# EAGLE design NP_5x5_2020 (EAGLE 6.5.0)
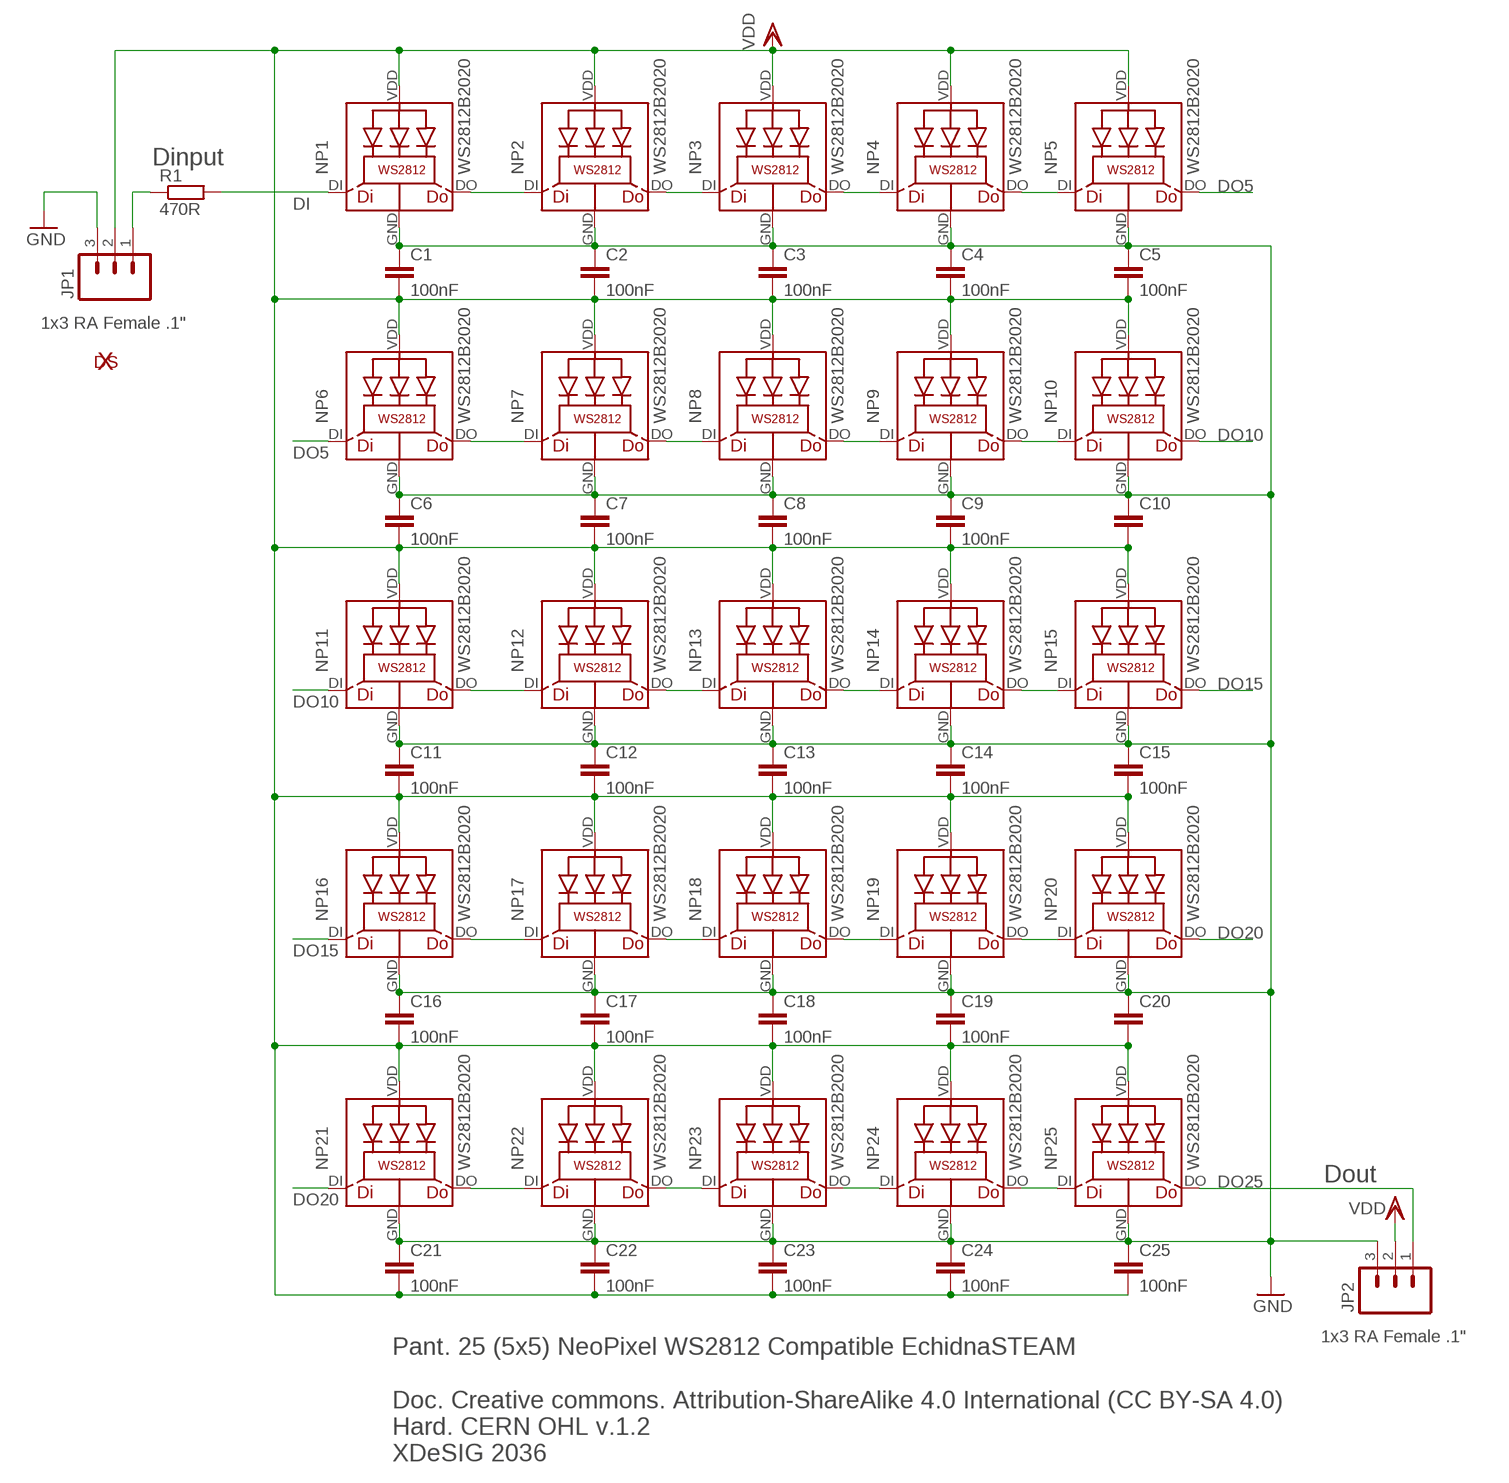
[diagram p0: schematic, sheet 1]

## Parts
C1  100nF  C-EUC0402  [C0402]
C2  100nF  C-EUC0402  [C0402]
C3  100nF  C-EUC0402  [C0402]
C4  100nF  C-EUC0402  [C0402]
C5  100nF  C-EUC0402  [C0402]
C6  100nF  C-EUC0402  [C0402]
C7  100nF  C-EUC0402  [C0402]
C8  100nF  C-EUC0402  [C0402]
C9  100nF  C-EUC0402  [C0402]
C10  C-EUC0402  [C0402]
C11  100nF  C-EUC0402  [C0402]
C12  100nF  C-EUC0402  [C0402]
C13  100nF  C-EUC0402  [C0402]
C14  100nF  C-EUC0402  [C0402]
C15  100nF  C-EUC0402  [C0402]
C16  100nF  C-EUC0402  [C0402]
C17  100nF  C-EUC0402  [C0402]
C18  100nF  C-EUC0402  [C0402]
C19  100nF  C-EUC0402  [C0402]
C20  C-EUC0402  [C0402]
C21  100nF  C-EUC0402  [C0402]
C22  100nF  C-EUC0402  [C0402]
C23  100nF  C-EUC0402  [C0402]
C24  100nF  C-EUC0402  [C0402]
C25  100nF  C-EUC0402  [C0402]
JP1  1x3 RA Female .1"  M03SMD_RA_FEMALE  [1X03_SMD_RA_FEMALE]
JP2  1x3 RA Female .1"  M03SMD_RA_FEMALE  [1X03_SMD_RA_FEMALE]
NP1  WS2812B2020  [2020]
NP2  WS2812B2020  [2020]
NP3  WS2812B2020  [2020]
NP4  WS2812B2020  [2020]
NP5  WS2812B2020  [2020]
NP6  WS2812B2020  [2020]
NP7  WS2812B2020  [2020]
NP8  WS2812B2020  [2020]
NP9  WS2812B2020  [2020]
NP10  WS2812B2020  [2020]
NP11  WS2812B2020  [2020]
NP12  WS2812B2020  [2020]
NP13  WS2812B2020  [2020]
NP14  WS2812B2020  [2020]
NP15  WS2812B2020  [2020]
NP16  WS2812B2020  [2020]
NP17  WS2812B2020  [2020]
NP18  WS2812B2020  [2020]
NP19  WS2812B2020  [2020]
NP20  WS2812B2020  [2020]
NP21  WS2812B2020  [2020]
NP22  WS2812B2020  [2020]
NP23  WS2812B2020  [2020]
NP24  WS2812B2020  [2020]
NP25  WS2812B2020  [2020]
R1  470R  R-EU_R0603  [R0603]
U$1  XDESIG_XDESIG5MM  [XDESIG_XDESIG_CU]

## Nets
DI: NP1.DI R1.2
DO5: NP5.DO NP6.DI
DO10: NP10.DO NP11.DI
DO15: NP15.DO NP16.DI
DO20: NP20.DO NP21.DI
DO25: JP2.1 NP25.DO
GND: C1.1 C2.1 C3.1 C4.1 C5.1 C6.1 C7.1 C8.1 C9.1 C10.1 C11.1 C12.1 C13.1 C14.1 C15.1 C16.1 C17.1 C18.1 C19.1 C20.1 C21.1 C22.1 C23.1 C24.1 C25.1 JP1.3 JP2.3 NP1.GND NP2.GND NP3.GND NP4.GND NP5.GND NP6.GND NP7.GND NP8.GND NP9.GND NP10.GND NP11.GND NP12.GND NP13.GND NP14.GND NP15.GND NP16.GND NP17.GND NP18.GND NP19.GND NP20.GND NP21.GND NP22.GND NP23.GND NP24.GND NP25.GND
N$1: NP1.DO NP2.DI
N$2: NP2.DO NP3.DI
N$3: NP3.DO NP4.DI
N$4: NP4.DO NP5.DI
N$5: NP22.DO NP23.DI
N$6: NP23.DO NP24.DI
N$7: NP6.DO NP7.DI
N$8: NP7.DO NP8.DI
N$9: NP8.DO NP9.DI
N$10: NP9.DO NP10.DI
N$11: NP11.DO NP12.DI
N$12: NP12.DO NP13.DI
N$13: NP13.DO NP14.DI
N$14: NP14.DO NP15.DI
N$15: NP16.DO NP17.DI
N$16: NP17.DO NP18.DI
N$17: NP18.DO NP19.DI
N$18: NP19.DO NP20.DI
N$19: NP21.DO NP22.DI
N$20: NP24.DO NP25.DI
N$21: JP1.1 R1.1
VDD: C1.2 C2.2 C3.2 C4.2 C5.2 C6.2 C7.2 C8.2 C9.2 C10.2 C11.2 C12.2 C13.2 C14.2 C15.2 C16.2 C17.2 C18.2 C19.2 C20.2 C21.2 C22.2 C23.2 C24.2 C25.2 JP1.2 JP2.2 NP1.VDD(LEDVDD) NP2.VDD(LEDVDD) NP3.VDD(LEDVDD) NP4.VDD(LEDVDD) NP5.VDD(LEDVDD) NP6.VDD(LEDVDD) NP7.VDD(LEDVDD) NP8.VDD(LEDVDD) NP9.VDD(LEDVDD) NP10.VDD(LEDVDD) NP11.VDD(LEDVDD) NP12.VDD(LEDVDD) NP13.VDD(LEDVDD) NP14.VDD(LEDVDD) NP15.VDD(LEDVDD) NP16.VDD(LEDVDD) NP17.VDD(LEDVDD) NP18.VDD(LEDVDD) NP19.VDD(LEDVDD) NP20.VDD(LEDVDD) NP21.VDD(LEDVDD) NP22.VDD(LEDVDD) NP23.VDD(LEDVDD) NP24.VDD(LEDVDD) NP25.VDD(LEDVDD)

## Notes on the sheet
- Dinput
- Dout
- Pant. 25 (5x5) NeoPixel WS2812 Compatible EchidnaSTEAM 
  
  Doc. Creative commons. Attribution-ShareAlike 4.0 International (CC BY-SA 4.0) 
  Hard. CERN OHL v.1.2
  XDeSIG 2036

## Library data of the parts
C1-C25 = rcl:C-EU: CAPACITOR, European symbol
JP1 JP2 = SparkFun-Connectors:M03: Header 3 Standard 3-pin 0.1" header. Use with straight break away headers (SKU : PRT-00116), right angle break away headers (PRT-00553), swiss pins (PRT-00743), machine pins (PRT-00117), and female headers (PRT-00115). Molex polarized connector foot print use with SKU : PRT-08232 with associated crimp pins and housings.; PROD_ID: CONN-10926
NP1-NP25 = adafruit:WS2812B
R1 = rcl:R-EU_: RESISTOR, European symbol
U$1 = cervus2.100:XDESIG_XDESIG

## Board
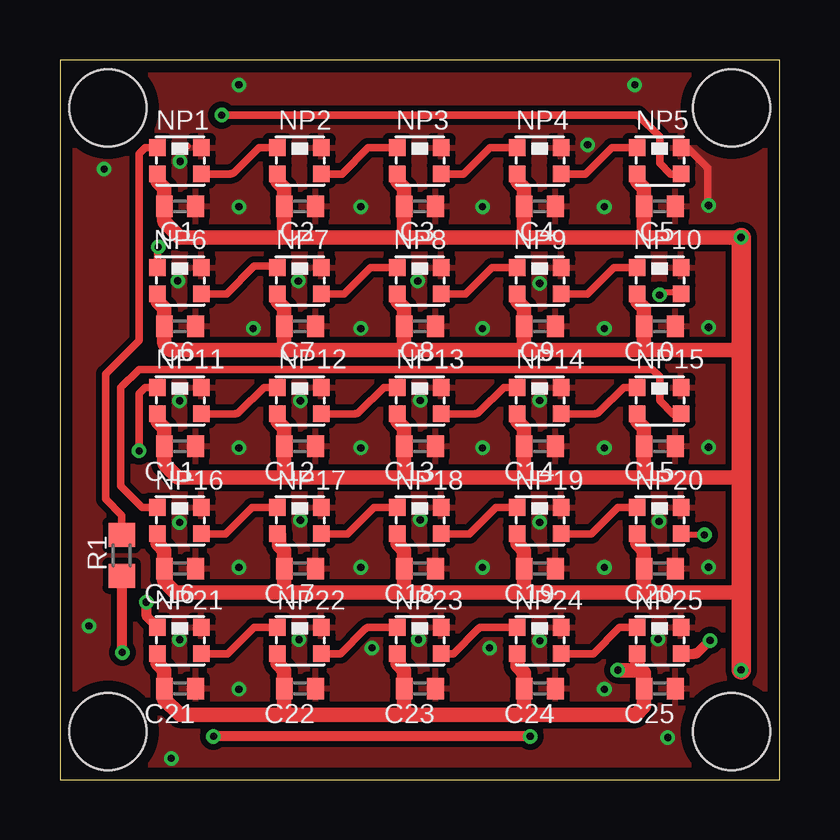
[diagram p1: board, top side]
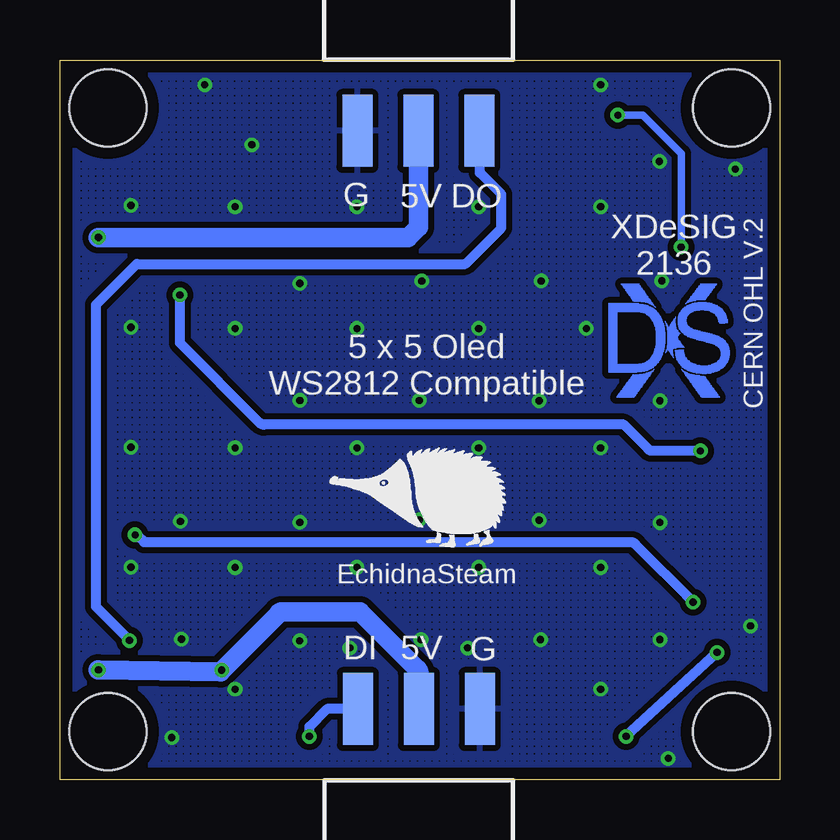
[diagram p2: board, bottom side, seen from below]

Size 30 x 30 mm. Coordinates in mm from the lower left corner, seen from the top.
Outline: 0,0 30,0 30,30 0,30 0,0
Copper layers (1*16): Top 0.035mm / dielectric 1.6mm / Bottom 0.035mm
Design rules "Elecrow_2-layer_PCB_eagle_rule": minimum track width 6mil, minimum drill 12mil, track to track 6mil, track to pad 8mil, pad to pad 12mil, via to via 12mil, smd to smd 0mil, copper to edge 20mil, drill to drill 10mil, minimum pad ring 6mil, minimum via ring 6mil, stop-mask expansion 0mil, vias tented up to drill 100mil, thermal gap 10mil
Holes 3.2 mm at 2,28 28,28 2,2 28,2

### Footprints (pad centres in the part's own frame; a part is rotated, then mirrored left to right if it is on the bottom)
C0402 = smd 0.7 x 0.9: 1 -0.65,0; 2 0.65,0
1X03_SMD_RA_FEMALE = smd 1.25 x 3: 1 -2.54,7.225; 2 0,7.225; 3 2.54,7.225
2020 = smd 0.7 x 0.7: DI -0.935,0.55; DO 0.895,-0.55; GND 0.895,0.55; VDD -0.935,-0.55
R0603 = smd 1 x 1.1: 1 -0.85,0; 2 0.85,0

### Placement (x,y rotation side)
C1  5,23.9 180 top
C2  10,23.9 180 top
C3  15,23.9 180 top
C4  20,23.9 180 top
C5  25,23.9 180 top
C6  5,18.9 180 top
C7  10,18.9 180 top
C8  15,18.9 180 top
C9  20,18.9 180 top
C10  25,18.9 180 top
C11  5,13.9 180 top
C12  10,13.9 180 top
C13  15,13.9 180 top
C14  20,13.9 180 top
C15  25,13.9 180 top
C16  5,8.8 180 top
C17  10,8.8 180 top
C18  15,8.8 180 top
C19  20,8.8 180 top
C20  25,8.8 180 top
C21  5,3.8 180 top
C22  10,3.8 180 top
C23  15,3.8 180 top
C24  20,3.8 180 top
C25  25,3.8 180 top
JP1  15.04,-4.28 0 bottom
JP2  15.06,34.27 180 bottom
NP1  5,25.8 0 top
NP2  10,25.8 0 top
NP3  15,25.8 0 top
NP4  20,25.8 0 top
NP5  25,25.8 0 top
NP6  5,20.8 0 top
NP7  10,20.8 0 top
NP8  15,20.8 0 top
NP9  20,20.8 0 top
NP10  25,20.8 0 top
NP11  5,15.8 0 top
NP12  10,15.8 0 top
NP13  15,15.8 0 top
NP14  20,15.8 0 top
NP15  25,15.8 0 top
NP16  5,10.8 0 top
NP17  10,10.8 0 top
NP18  15,10.8 0 top
NP19  20,10.8 0 top
NP20  25,10.8 0 top
NP21  5,5.8 0 top
NP22  10,5.8 0 top
NP23  15,5.8 0 top
NP24  20,5.8 0 top
NP25  25,5.8 0 top
R1  2.58,9.34 90 top
U$1  7.13,15.93 0 bottom
U$3  [ECHIDNA_P]  18.8,9.64 0 bottom

### Tracks (layer width: path | path; a pad name or v marks a point on that pad's centre or on a via)
DI
  Top 0.305: R1.2 2.58,11.02 1.9,11.7 1.9,16.9 3.3,18.3 3.3,26.1 3.55,26.35 NP1.DI
DO5  (via drill 0.3)
  Top 0.305: NP6.DI 4.07,22.07 v4.1,22.2 | 8.65,27.7 v6.74,27.7 24.1,27.7 25,26.8 25,25.7 25.45,25.25 NP5.DO
  Bottom 0.305: v4.1,22.2 4.1,26.1 5.7,27.7 v6.74,27.7
DO10  (via drill 0.3)
  Top 0.254: NP10.DO 25.65,20.32 25.15,20.32 v25,20.2
  Top 0.305: v3.3,13.7 3.3,16.1 3.55,16.35 NP11.DI
  Bottom 0.406: 25,20.02 v25,20.2 25,18.2 21.67,14.87 arc-45 21.5,14.8 6.5,14.8 5.47,13.77 arc-45 5.29,13.7 v3.3,13.7
DO15
  Top 0.305: NP16.DI 3.42,11.35 2.54,12.23 2.54,16.34 3.3,17.1 24.7,17.1 25,16.8 25,15.8 25.55,15.25 NP15.DO
DO20  (via drill 0.3)
  Top 0.254: v26.87,10.2 25.84,10.2 NP20.DO
  Top 0.406: v3.6,7.4 3.6,6.92 arc45 3.67,6.74 NP21.DI
  Bottom 0.406: 3.93,7.73 v3.6,7.4 6.03,9.83 arc-45 6.21,9.9 26.5,9.9 26.75,10.15 arc-45 v26.87,10.2
DO25  (via drill 0.3)
  Top 0.406: NP25.DO 26.45,5.25 arc45 26.62,5.32 v27.1,5.8
  Bottom 0.406: 12.2,27.02 JP2.1 12.5,27.02 12.5,25.3 11.6,24.4 11.6,23 13.1,21.5 26.8,21.5 28.5,19.8 28.5,7.2 v27.1,5.8
GND  (via drill 0.3)
  Top 0.254: C21.1 5.59,3.85 5.7,3.85 | NP1.GND 5.84,26.42 5.84,26.4 | 5.33,26.42 5.33,26.4
  Top 0.305: NP5.GND 26.15,26.35 27,25.5 27,23.97 v27.04,23.93
  other vias: 7.46,23.88 12.54,23.88 17.62,23.88 22.7,23.88 8.06,18.8 12.54,18.8 17.62,18.8 22.7,18.8 7.46,13.82 12.54,13.82 17.62,13.82 22.7,13.82 7.46,8.84 12.54,8.84 17.62,8.84 22.7,8.84 7.46,3.76 22.7,3.76 25.34,1.75 24.94,5.85 27.04,8.85 27.04,13.85 27.04,18.85 7.46,28.96 20,20.68 22,26.46 14.92,20.78 9.94,20.78 4.91,20.79 5.01,25.77 20,15.8 15.02,15.8 4.99,15.79 10.02,15.79 4.99,10.71 10.02,10.81 15.02,10.82 20,10.72 24.98,10.76 4.99,5.83 9.97,5.83 14.95,5.83 20.01,5.78 17.91,5.48 13.01,5.48 1.84,25.45 1.21,6.4 4.64,0.88 23.97,28.96
  pour Bottom (isolate 0.254, hatched): 0,0 0.1,30.28 30.33,30.28 arc-90 30.48,30.23 30.48,0
  pour Top (isolate 0.254): 0,0 0,30.68 28.96,30.68 arc-90 30.51,30.33 30.51,0.1
N$1
  Top 0.305: NP1.DO 7.09,25.25 arc45 7.27,25.32 8.3,26.35 NP2.DI
N$2
  Top 0.305: NP2.DO 11.75,25.25 12.85,26.35 NP3.DI
N$3
  Top 0.305: NP3.DO 16.83,25.25 17.93,26.35 NP4.DI
N$4
  Top 0.305: NP4.DO 21.91,25.25 23.01,26.35 NP5.DI
N$5
  Top 0.305: NP22.DO 11.7,5.25 12.73,6.28 arc-45 12.9,6.35 NP23.DI
N$6
  Top 0.305: NP23.DO 16.4,5.25 17.43,6.28 arc-45 17.61,6.35 NP24.DI
N$7
  Top 0.305: NP6.DO 6.95,20.25 8.1,21.4 9.02,21.4 NP7.DI
N$8
  Top 0.305: NP8.DI 12.95,21.35 11.85,20.25 NP7.DO
N$9
  Top 0.305: NP8.DO 16.91,20.25 18.01,21.35 NP9.DI
N$10
  Top 0.305: NP9.DO 21.99,20.25 23.09,21.35 NP10.DI
N$11
  Top 0.305: NP11.DO 7.29,15.25 arc45 7.47,15.32 8.5,16.35 NP12.DI
N$12
  Top 0.305: NP12.DO 12.29,15.25 arc45 12.47,15.32 13.5,16.35 NP13.DI
N$13
  Top 0.305: NP13.DO 17.3,15.25 arc45 17.47,15.32 18.5,16.35 NP14.DI
N$14
  Top 0.305: NP14.DO 22.3,15.25 arc45 22.47,15.32 23.5,16.35 NP15.DI
N$15
  Top 0.305: NP16.DO 6.91,10.25 8.01,11.35 NP17.DI
N$16
  Top 0.305: NP17.DO 11.99,10.25 13.09,11.35 NP18.DI
N$17
  Top 0.305: NP18.DO 17.07,10.25 18.17,11.35 NP19.DI
N$18
  Top 0.305: NP19.DO 22.15,10.25 23.25,11.35 NP20.DI
N$19
  Top 0.305: NP21.DO 6.99,5.25 8.09,6.35 NP22.DI
N$20
  Top 0.305: NP24.DO 22.23,5.25 23.33,6.35 NP25.DI
N$21  (via drill 0.3)
  Top 0.406: v19.6,1.8 v6.4,1.8 | R1.1 2.58,5.32 v2.6,5.3
  Bottom 0.406: v19.6,1.8 19.6,2.2 18.86,2.94 JP1.1 | v6.4,1.8 v2.6,5.3
VDD  (via drill 0.3)
  Top 0.254: 9.14,10.2 NP17.VDD | 13.97,25.15 NP3.VDD
  Top 0.61: NP25.VDD 24.07,4.74 24.15,4.65 | 24.15,4.65 24.35,4.45 C25.2 24.35,3.05 24,2.7 19.3,2.7 | NP24.VDD 19.07,4.74 19.35,4.45 C24.2 19.35,2.75 19.3,2.7 | NP23.VDD 14.06,4.83 14.35,4.55 C23.2 14.35,2.75 14.4,2.7 | NP22.VDD 9.06,4.83 9.35,4.55 C22.2 9.35,2.75 9.3,2.7 | NP21.VDD 4.07,4.83 4.35,4.55 C21.2 4.35,3.35 5,2.7 9.3,2.7 | NP20.VDD 24.07,9.84 24.35,9.55 C20.2 24.35,7.92 arc45 24.38,7.84 arc45 24.4,7.8 | NP1.VDD 4.07,24.93 4.35,24.65 C1.2 4.35,23.36 arc45 4.42,23.18 5,22.6 9.5,22.6 | NP2.VDD 9.06,24.93 9.35,24.65 C2.2 9.35,22.86 arc45 9.42,22.68 9.5,22.6 | NP3.VDD 14.06,24.93 14.35,24.65 C3.2 14.35,22.72 arc-45 14.3,22.6 | NP4.VDD 19.07,24.93 19.35,24.65 C4.2 19.35,22.72 arc-45 19.3,22.6 | NP5.VDD 24.07,24.93 24.35,24.65 C5.2 24.35,22.72 arc45 24.4,22.6 | NP6.VDD 4.07,19.93 4.35,19.65 C6.2 4.35,18.25 arc45 4.42,18.08 4.6,17.9 9.3,17.9 | NP7.VDD 9.06,19.93 9.35,19.65 C7.2 9.35,18.02 arc-45 9.3,17.9 | NP8.VDD 14.06,19.93 14.35,19.65 C8.2 14.35,18.02 arc45 14.4,17.9 | NP9.VDD 19.07,19.93 19.35,19.65 C9.2 19.35,18.02 arc-45 19.3,17.9 | NP10.VDD 24.07,19.93 24.35,19.65 C10.2 24.35,18.02 arc45 24.4,17.9 | NP19.VDD 19.07,9.84 19.35,9.55 C19.2 19.35,7.92 arc45 19.4,7.8 | NP18.VDD 14.06,9.84 14.35,9.55 C18.2 14.35,7.92 arc45 14.4,7.8 | 9.14,10.2 9.14,9.76 9.35,9.55 C17.2 9.35,7.92 arc-45 9.3,7.8 | NP16.VDD 4.07,9.84 4.35,9.55 C16.2 4.35,8.36 arc45 4.42,8.18 4.8,7.8 9.3,7.8 | NP11.VDD 4.07,14.94 4.35,14.65 C11.2 4.35,13.26 arc45 4.42,13.08 4.9,12.6 9.4,12.6 | NP12.VDD 9.06,14.94 9.35,14.65 C12.2 9.35,12.72 arc45 9.4,12.6 | NP13.VDD 14.06,14.94 14.35,14.65 C13.2 14.35,12.72 arc45 14.4,12.6
  Top 0.61: NP14.VDD 19.07,14.94 19.35,14.65 C14.2 19.35,12.72 arc-45 19.3,12.6 | NP15.VDD 24.07,14.94 24.35,14.65 C15.2 24.35,12.86 arc45 24.42,12.68 24.5,12.6 | 9.5,22.6 14.3,22.6 | 14.3,22.6 19.3,22.6 | 19.3,22.6 24.4,22.6 | 24.4,22.6 v28.4,22.6 | 9.3,17.9 14.4,17.9 | 14.4,17.9 19.3,17.9 | 19.3,17.9 24.4,17.9 | 24.4,17.9 28.4,17.9 | 9.4,12.6 14.4,12.6 | 14.4,12.6 19.3,12.6 | 19.3,12.6 24.5,12.6 | 24.5,12.6 28.2,12.6 arc45 28.37,12.67 28.4,12.7 | 9.3,7.8 14.4,7.8 | 14.4,7.8 19.4,7.8 | 19.4,7.8 24.4,7.8 | 24.4,7.8 28.11,7.8 arc-45 28.29,7.73 28.4,7.62 | v23.26,4.56 24.04,4.56 | 24.04,4.56 arc-45 24.2,4.5 | 9.3,2.7 14.4,2.7 | 14.4,2.7 19.3,2.7 | 24.04,4.56 24.06,4.56 24.15,4.65
  Top 0.813: v28.4,4.57 28.4,7.62 28.4,12.7 28.4,17.9 v28.4,22.6
  Bottom 0.254: 15.24,3.05 JP1.2
  Bottom 0.61: 23.3,4.5 arc45 23.29,4.53 v23.26,4.56
  Bottom 0.813: JP1.2 15.04,4.43 arc-45 15.11,4.61 17.5,7 20.7,7 arc-45 20.87,6.93 23.3,4.5 v28.4,4.57 | v28.4,22.6 15.5,22.6 15.06,23.04 JP2.2

### Text on the board
tPlace: NP1 | NP2 | NP3 | NP4 | NP5 | NP6 | NP7 | NP8 | NP9 | NP10 | NP11 | NP12 | NP13 | NP14 | NP15 | NP16 | NP17 | NP18 | NP19 | NP20 | NP21 | NP22 | NP23 | NP24 | NP25
bPlace: DO | 5V | G | XDeSIG / 2136 | CERN OHL V.2 | 5 x 5 Oled / WS2812 Compatible | EchidnaSteam | G | 5V | DI